# Altium schematic sheet EInkHeader.SchDoc
size A4; SheetNumber: 12; SheetTotal: 13
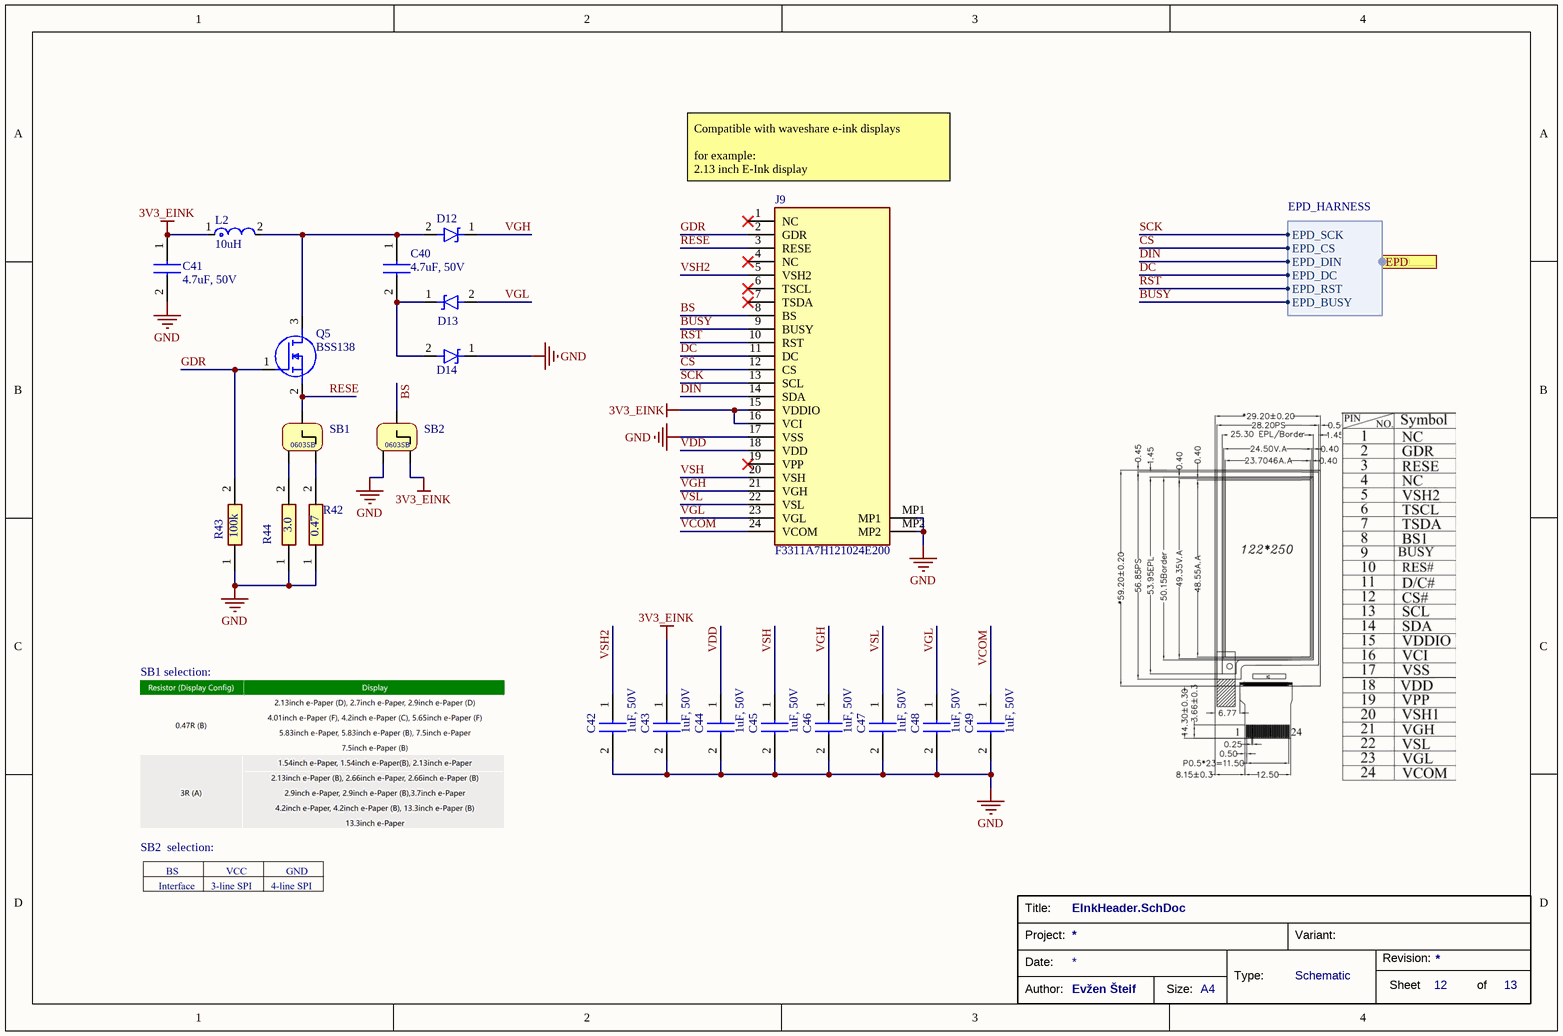
[diagram p0: EInkHeader.SchDoc]

## Parts
C40  4.7uF, 50V  [CAPC2012X145N]
C41  4.7uF, 50V  [CAPC2012X145N]
C42  1uF, 50V  [CAPC1608X90N]
C43  1uF, 50V  [CAPC1608X90N]
C44  1uF, 50V  [CAPC1608X90N]
C45  1uF, 50V  [CAPC1608X90N]
C46  1uF, 50V  [CAPC1608X90N]
C47  1uF, 50V  [CAPC1608X90N]
C48  1uF, 50V  [CAPC1608X90N]
C49  1uF, 50V  [CAPC1608X90N]
D12  MBR0530T1G  [SOD3716X135N]  (value not drawn)
D13  MBR0530T1G  [SOD3716X135N]  (value not drawn)
D14  MBR0530T1G  [SOD3716X135N]  (value not drawn)
J9  F3311A7H121024E200  [F3311A7H121024E200]
L2  10uH  [FP-EPL2010_H1_05-MFG]
Q5  BSS138  [SOT95P240X120-3N]
R42  0.47  [ERJ3_B_BQ_BW_LW_(0603)]
R43  100k  [RESC1005X35N]
R44  3.0  [ERJ3_B_BQ_BW_LW_(0603)]
SB1  SP0603_RIGHT  [SP0603-RIGHT]  (value not drawn)
SB2  SP0603_RIGHT  [SP0603-RIGHT]  (value not drawn)

## Ports
EPD (harness EPD_HARNESS, see main[3C], MCU[3C])

## Harnesses
EPD_HARNESS: EPD_DIN, EPD_SCK, EPD_CS, EPD_DC, EPD_RST, EPD_BUSY

## Nets
3V3_EINK: C41.1 C43.1 J9.15(VDDIO) J9.16(VCI) L2.1 SB2.2
GND: C41.2 C42.2 C43.2 C44.2 C45.2 C46.2 C47.2 C48.2 C49.2 D14.1(K) J9.17(VSS) J9.MP1 J9.MP2 R42.1 R43.1 R44.1 SB2.3
BS: J9.8(BS) SB2.1
BUSY: J9.9(BUSY) ; port EPD.EPD_BUSY
CS: J9.12(CS) ; port EPD.EPD_CS
DC: J9.11(DC) ; port EPD.EPD_DC
DIN: J9.14(SDA) ; port EPD.EPD_DIN
GDR: J9.2(GDR) Q5.1(G) R43.2
RESE: J9.3(RESE) Q5.2(S) SB1.1
RST: J9.10(RST) ; port EPD.EPD_RST
SCK: J9.13(SCL) ; port EPD.EPD_SCK
VCOM: C49.1 J9.24(VCOM)
VDD: C44.1 J9.18(VDD)
VGH: C46.1 D12.1(K) J9.21(VGH)
VGL: C48.1 D13.2(A) J9.23(VGL)
VSH: C45.1 J9.20(VSH)
VSH2: C42.1 J9.5(VSH2)
VSL: C47.1 J9.22(VSL)
NetC40_1: C40.1 D12.2(A) L2.2 Q5.3(D)
NetC40_2: C40.2 D13.1(K) D14.2(A)
NetR42_2: R42.2 SB1.2
NetR44_2: R44.2 SB1.3

Not connected (* = marked no-connect by the designer): J9 1(NC)* 4(NC)* 6(TSCL)* 7(TSDA)* 19(VPP)*

## Notes on the sheet
- (near J9) Compatible with waveshare e-ink displays
  for example:
  2.13 inch E-Ink display
- SB1 selection:
- SB2  selection:
- Title:
- Date:
- Project:
- Type:
- Schematic
- Variant:
- Revision:
- Sheet
- of
- Author:
- Evžen Šteif
- Size:
- A4
- (in symbol SP0603_RIGHT) 0603SB

## Library data of the parts
C40 C41 = GRM21BR61H475KE51L: Capacitor; Manufacturer_Name: Murata Electronics; Datasheet Link: https://search.murata.co.jp/Ceramy/image/img/A01X/G101/ENG/GRM21BR61H475KE51-01A.pdf; Height: 1.45mm; Manufacturer_Part_Number: GRM21BR61H475KE51L; Mouser Part Number: 81-GRM21BR61H475KE1L; Mouser Price/Stock: https://www.mouser.co.uk/ProductDetail/Murata-Electronics/GRM21BR61H475KE51L?qs=eeBpzGFlv%252B%252BOtLzDC1PY6Q%3D%3D; Arrow Part Number: GRM21BR61H475KE51L; Arrow Price/Stock: https://www.arrow.com/en/products/grm21br61h475ke51l/murata-manufacturing?region=nac
C42-C49 = GRT188R61H105KE13D: Capacitor; Manufacturer_Name: Murata Electronics; Datasheet Link: https://search.murata.co.jp/Ceramy/image/img/A01X/G101/ENG/GRT188R61H105KE13-01A.pdf; Height: 0.9mm; Manufacturer_Part_Number: GRT188R61H105KE13D; Mouser Part Number: 81-GRT188R61H105KE3D; Mouser Price/Stock: https://www.mouser.co.uk/ProductDetail/Murata-Electronics/GRT188R61H105KE13D?qs=drgMNd%252BkGPNIxxtJByMGCg%3D%3D; Arrow Part Number: GRT188R61H105KE13D; Arrow Price/Stock: https://www.arrow.com/en/products/grt188r61h105ke13d/murata-manufacturing?region=nac
D12-D14 = MBR0530T1G: Diode; Manufacturer_Name: onsemi; Datasheet Link: https://www.onsemi.com/pub/Collateral/MBR0530T1-D.PDF; Height: 1.35mm; Manufacturer_Part_Number: MBR0530T1G; Mouser Part Number: 863-MBR0530T1G; Mouser Price/Stock: https://www.mouser.co.uk/ProductDetail/onsemi/MBR0530T1G?qs=3JMERSakeboS%2FFOxJUMWeg%3D%3D; Arrow Part Number: MBR0530T1G; Arrow Price/Stock: https://www.arrow.com/en/products/mbr0530t1g/on-semiconductor?utm_currency=USD&region=europe
J9 = F3311A7H121024E200: Connector; Manufacturer_Name: Amphenol Communications Solutions; Datasheet Link: https://cdn.amphenol-cs.com/media/wysiwyg/files/documentation/datasheet/flex/ffc_fpc_050mm_f331.pdf; Height: 1.12mm; Manufacturer_Part_Number: F3311A7H121024E200; Mouser Part Number: 649-311A7H121024E200; Mouser Price/Stock: https://www.mouser.co.uk/ProductDetail/Amphenol-ICC-Aorora/F3311A7H121024E200/?qs=DPoM0jnrROXxrFUCHSrvbQ%3D%3D; Arrow Part Number: F3311A7H121024E200; Arrow Price/Stock: https://www.arrow.com/en/products/f3311a7h121024e200/amphenol-fci?region=nac
L2 = CMP-01768-06743366-1: EPL2010-103MLC Power inductor, shielded, 20% tol, SMT, RoHS; Core Material: Ferrite; Inductance: 10µH; RMS Current (Irms): 495mA; DC Resistance (DCR): 1Ω; Self Resonant Frequency: 33MHz; Test Frequency: 100kHz; Saturation Current: 200mA; Width: 2.2mm; Ambient Temperature Range High: 85°C; Lifecycle Status: Production; Case/Package: 0808; Max Operating Temperature: 85°C; RoHS: Compliant; Termination: SMD/SMT; Length: 2.2mm; NexarPartId: 6743366; Height: 1.05mm; Tolerance: 20%; Max DC Current: 495mA; Shielding: Shielded; Lead Free: Contains Lead; Series Resistance: 1Ω; Min Operating Temperature: -40°C
Q5 = BSS138: MOSFET (N-Channel); Manufacturer_Name: onsemi; Datasheet Link: https://www.onsemi.com/pub/Collateral/BSS138-D.PDF; Height: 1.2mm; Manufacturer_Part_Number: BSS138; Mouser Part Number: 512-BSS138; Mouser Price/Stock: https://www.mouser.co.uk/ProductDetail/onsemi-Fairchild/BSS138?qs=HK%252BeIG1iaahCeqBvjB4arg%3D%3D; Arrow Part Number: BSS138; Arrow Price/Stock: https://www.arrow.com/en/products/bss138/on-semiconductor?utm_currency=USD&region=europe
R42 = ERJ-3BQFR47V: Resistor; Manufacturer_Name: Panasonic; Datasheet Link: http://industrial.panasonic.com/cdbs/www-data/pdf/RDN0000/AOA0000C313.pdf; Manufacturer_Part_Number: ERJ-3BQFR47V; Mouser Part Number: 667-ERJ-3BQFR47V; Mouser Price/Stock: https://www.mouser.co.uk/ProductDetail/Panasonic/ERJ-3BQFR47V?qs=vIi9VVzGal8PcLrBRduGlQ%3D%3D
R43 = RT0402FRE07100KL: Resistor; Manufacturer_Name: KEMET; Datasheet Link: https://www.yageo.com/upload/media/product/productsearch/datasheet/rchip/PYu-RT_1-to-0.01_RoHS_L_11.pdf; Height: 0.35mm; Manufacturer_Part_Number: RT0402FRE07100KL; Mouser Part Number: 603-RT0402FRE07100KL; Mouser Price/Stock: https://www.mouser.co.uk/ProductDetail/YAGEO/RT0402FRE07100KL?qs=BXCcY9r%252B08CxTvf5JB1kiw%3D%3D; Arrow Part Number: RT0402FRE07100KL; Arrow Price/Stock: https://www.arrow.com/en/products/rt0402fre07100kl/yageo
R44 = ERJ-3RQF3R0V: Resistor; Manufacturer_Name: Panasonic; Datasheet Link: http://industrial.panasonic.com/cdbs/www-data/pdf/RDN0000/AOA0000C313.pdf; Manufacturer_Part_Number: ERJ-3RQF3R0V; Mouser Part Number: 667-ERJ-3RQF3R0V; Mouser Price/Stock: https://www.mouser.co.uk/ProductDetail/Panasonic/ERJ-3RQF3R0V?qs=KH2o3k57USiq02y4kowEUQ%3D%3D